# Altium schematic sheet Main.SchDoc
size A0; SheetNumber: 1; SheetTotal: 1
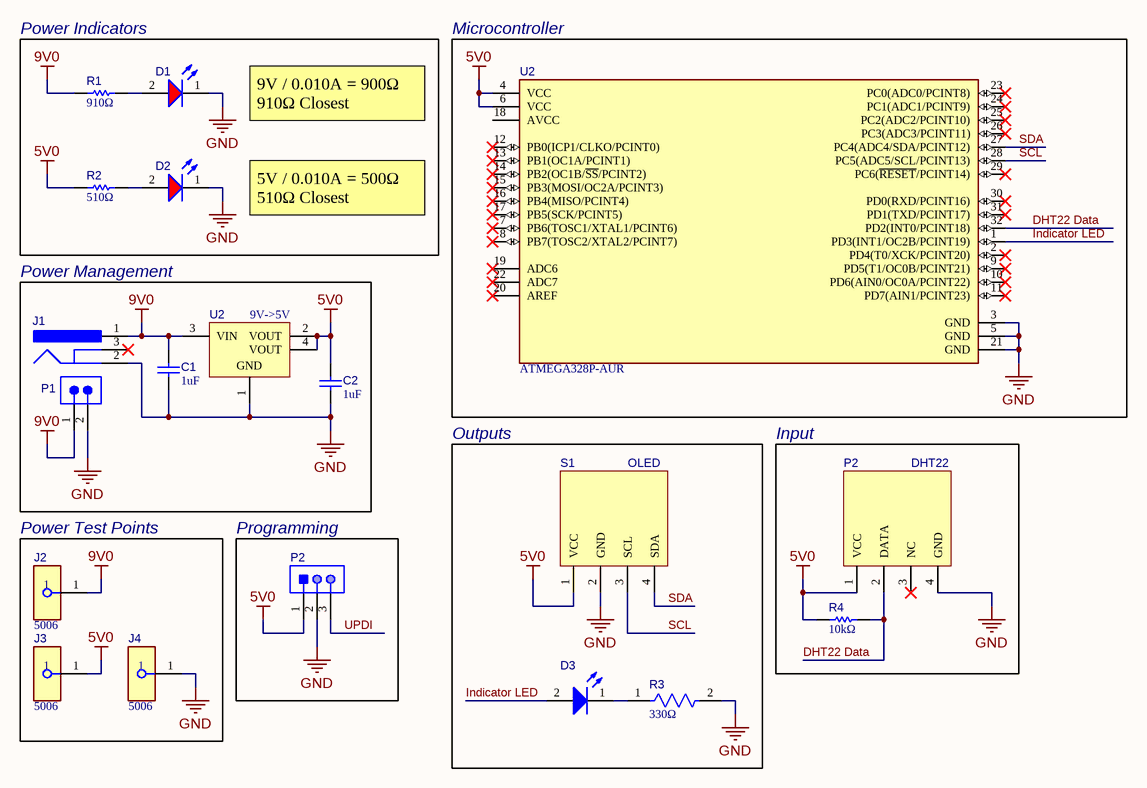
[diagram p0: Main.SchDoc]

## Parts
(Parts that share a designator on the sheet are numbered #1, #2 ... from top to bottom, then left to right.)
C1  1uF  [CAPC3216X180X50ML20T25]
C2  1uF  [CAPC3216X180X50ML20T25]
D1  150120SS75000  [WL-SMCW_1206_150120xx75000]  (value not drawn)
D2  150120SS75000  [WL-SMCW_1206_150120xx75000]  (value not drawn)
D3  150120BS75000  [WL-SMCW_1206_150120xx75000]  (value not drawn)
J1  Power Jack  [CUI-PJ-002A_V]  (value not drawn)
J2  5006  [FP-5006-MFG]
J3  5006  [FP-5006-MFG]
J4  5006  [FP-5006-MFG]
P1  61300211121  [61300211121]  (value not drawn)
P2#1  DHT22  [DHT22]
P2#2  22-23-2031  [MOLX-22-23-2031_V]  (value not drawn)
R1  910Ω  [RESC3216X70X50ML20T25]
R2  510Ω  [RESC3216X60X45ML10T20]
R3  330Ω  [FP-CRCW1206-e3-IPC_A]
R4  10kΩ  [RESC3116X65X40ML10T20]
S1  OLED  [display]
U2#1  ATMEGA328P-AUR  [FP-32A-MFG]
U2#2  9V->5V  [SOT-223_L]

## Blocks framed on the sheet
Power Indicators: D1 D2 R1 R2
Microcontroller: U2#1
Power Management: C1 C2 J1 P1 U2#2
Outputs: D3 R3 S1
Input: P2#1 R4
Power Test Points: J2-J4
Programming: P2#2

## Nets
5V0: C2.2 J3.1 P2#1.1(VCC) P2#2.1 R2.1 R4.1 S1.1(VCC) U2#1.4(VCC) U2#1.6(VCC) U2#2.2(VOUT) U2#2.4(VOUT)
9V0: C1.2 J1.1 J2.1 P1.1 R1.1 U2#2.3(VIN)
GND: C1.1 C2.1 D1.1(K) D2.1(K) J1.2 J4.1 P1.2 P2#1.4(GND) P2#2.2 R3.2 S1.2(GND) U2#1.3(GND) U2#1.5(GND) U2#1.21(GND) U2#2.1(GND)
DHT22 Data: P2#1.2(DATA) R4.2 U2#1.32(PD2(INT0/PCINT18))
Indicator LED: D3.2(A) U2#1.1(PD3(INT1/OC2B/PCINT19))
SCL: S1.3(SCL) U2#1.28(PC5(ADC5/SCL/PCINT13))
SDA: S1.4(SDA) U2#1.27(PC4(ADC4/SDA/PCINT12))
UPDI: P2#2.3
NetD1_2: D1.2(A) R1.2
NetD2_2: D2.2(A) R2.2
NetD3_1: D3.1(K) R3.1

Not connected (* = marked no-connect by the designer): J1 3*; P2#1 3(NC)*; U2#1 2(PD4(T0/XCK/PCINT20))* 7(PB6(TOSC1/XTAL1/PCINT6))* 8(PB7(TOSC2/XTAL2/PCINT7))* 9(PD5(T1/OC0B/PCINT21))* 10(PD6(AIN0/OC0A/PCINT22))* 11(PD7(AIN1/PCINT23))* 12(PB0(ICP1/CLKO/PCINT0))* 13(PB1(OC1A/PCINT1))* 14(PB2(OC1B/~{SS}/PCINT2))* 15(PB3(MOSI/OC2A/PCINT3))* 16(PB4(MISO/PCINT4))* 17(PB5(SCK/PCINT5))* 18(AVCC) 19(ADC6)* 20(AREF)* 22(ADC7)* 23(PC0(ADC0/PCINT8))* 24(PC1(ADC1/PCINT9))* 25(PC2(ADC2/PCINT10))* 26(PC3(ADC3/PCINT11))* 29(PC6(~{RESET}/PCINT14))* 30(PD0(RXD/PCINT16))* 31(PD1(TXD/PCINT17))*

## Notes on the sheet
- 9V / 0.010A = 900Ω 910Ω Closest
- 5V / 0.010A = 500Ω 510Ω Closest

## Library data of the parts
C1 C2 = CMP-2000-04991-1: Chip Capacitor, 1 uF, +/- 10%, 25 V, -55 to 125 degC, 1206 (3216 Metric), RoHS, Tape and Reel; Manufacturer: Kemet; Temperature Coefficient / Code: +/-15%; Dielectric: X7R; Voltage Rating DC: 25V; Capacitance - nF: 1000nF; Class: Class1; Case Length: 3.2mm; Type: SMDMLCCX7R6.3-250VDCCommericalGrade; Case Width: 1.6mm; Product: GeneralTypeMLCCs; Capacitance: 1uF; Datasheet URL: https://ciiva.com/datasheet-click-18194173?src=ciiva&sig=6daff8c4; Operating Temperature Range: -55Cto+125C; Series: C1206C; RoHS: Details; Product Category: MultilayerCeramicCapacitorsMLCC-SMD/SMT; Manufacturer URL: http://www.kemet.com/; Minimum Operating Temperature: -55C; Dimensions: 1.6mmWx3.2mmLx1.6mmH; Termination Style: SMD/SMT; Brand: Kemet; Packaging: Reel; Package / Case: 1206(3216metric); Case Code - mm: 3216; Datasheet Version: Jul-14; Factory Pack Quantity: 2000; Package Description: 2-Pin Surface Mount Device, Body 3.2 x 1.6 mm; Tolerance: 10%; Package Reference: 1206; Case Height: 1.6mm; Case Code - in: 1206; Maximum Operating Temperature: +125C; Voltage Rating: 25V
D1 D2 = CMP-1426-00017-3: Led, Red, 630 Nm, 1.9 V, 30 Ma, 60 Mcd Rohs Compliant: Yes; Forward Current: 100mA; Max Reverse Voltage (DC): 5V; Lens Style: Clear, Rectangular; Viewing Angle: 140°; Luminous Intensity: 60mcd; Peak Wavelength: 645nm; Forward Voltage: 1.9V; Test Current: 20mA; Dominant Wavelength: 630nm; Case Code (Imperial): 1206; Length: 3.2mm; Mount: Surface Mount; Case Code (Metric): 3216; Case/Package: 1206; Min Operating Temperature: -40°C; Width: 1.6mm; Color: Red; Height: 680µm; REACH SVHC: Unknown; Max Operating Temperature: 85°C; Wavelength: 630nm; RoHS: Compliant; Packaging: Tape and Reel
D3 = CMP-1426-00015-3: WL-SMCW SMT Mono-Color Chip LED Waterclear; Manufacturer Package Identifier: LED_1206; Dominant Wavelength: 470nm; Lens Style: Clear, Rectangular; Test Current: 20mA; Forward Voltage: 3.2V; Forward Current: 100mA; Peak Wavelength: 465nm; Max Reverse Voltage (DC): 5V; Viewing Angle: 140°; Color: Blue; Luminous Intensity: 145mcd; Max Operating Temperature: 85°C; Case Code (Imperial): 1206; Length: 3.2mm; Width: 1.6mm; Min Operating Temperature: -40°C; Height: 680µm; Case Code (Metric): 3216; Packaging: Tape and Reel; RoHS: Compliant; Case/Package: 1206; REACH SVHC: Unknown; Wavelength: 470nm; Mount: Surface Mount
J1 = CMP-2000-06895-2: Through Hole Right Angle DC Power Jack, 2.5 A, 2 mm Center Pin, 3 Position, -25 to 85 degC, RoHS, Bulk; Manufacturer: CUIInc.; Brand: CUI; Inside Contact Diameter: 2mm; Voltage Rating: 24V; Outside Contact Diameter: 6.5mm; Current Rating: 2.5A; Insulation Resistance: 50MOhms; Contact Gender: Male; Connector Type: DCPowerJack; Datasheet Version: Rev. 1.03, 04/2016; Housing Material: PolybutyleneTerephthalate(PBT); Operating Temperature Range: -25Cto+85C; Termination Style: ThroughHole; Product Category: DCPowerConnectors; Mounting Technology: ThroughHole; Mounting Style: ThroughHole; Factory Pack Quantity: 500; Contact Plating: Nickel; Package Reference: PJ-002A; Mounting Angle: Right; Package Description: 3-Pin Through Hole Device, Body 14.4 x 9 mm, Height 11 mm; Flammability Rating: UL94V-0; Manufacturer URL: http://www.cui.com/; Product: Jacks; Contact Material: Copper; Datasheet URL: http://www.cui.com/product/resource/pj-002a.pdf; RoHS: True
J2-J4 = CMP-19636-000022-1: PC TEST POINT COMPACT BLACK; Body Material: Bronze; Inside Diameter: 1.78mm; Number of Ports: 1; Hole Diameter: 1.6mm; Outside Diameter: 3.18mm; Plating: Silver; Contact Plating: Tin; Color: Black; RoHS Compliant: Yes; Flammability Rating: UL94 V-0; Contact Material: Bronze; Material: Nylon; Orientation: Straight; Package Quantity: 100; Housing Color: Black; Length: 8.89mm; Series: THM; Mount: PCB; Height: 0.35inch; Packaging: Bulk; REACH SVHC: No SVHC; Insulation Material: Nylon; Lead Free: Lead Free
P1 = CMP-1712-00002-6: NexarPartId: 20081794; Number of Contacts: 2; Pitch: 2.54mm; Connector Type: Male Pin; Voltage Rating: 250V; Current Rating: 3A; Gender: Male; Contact Resistance: 20mΩ; Height: 8.94mm; Lead Free: Lead Free; Number of Pins: 2; Termination: Through Hole; RoHS: Compliant; Lead Pitch: 2.54mm; REACH SVHC: No SVHC; Housing Material: PBT; Contact Mating Length: 5.9944mm; Min Operating Temperature: -40°C; Orientation: Vertical; Contact Material: Copper; Contact Gender: Male; Max Operating Temperature: 125°C; Number of Rows: 1; Number of Positions: 2; Packaging: Bulk; Contact Plating: Gold; Mount: Through Hole; Color: Black; Operating Supply Voltage: 250V
P2#1 = DHT22: 4.2 mm Pitch Mini-Fit Jr.Power Connector, Vertical, Through Hole, 6 Circuits, -40 to 105 degC, RoHS, Bag; Pitch: 4.2 mm; No. of Positions: 6; No. of Rows: 2; PartNumber: 39-28-1063; ComponentLink3Description: Package Specification; ComponentLink1URL: http://www.molex.com/; PackageVersion: Rev. F, 06/2009; Orientation: Vertical; ComponentLink3URL: http://www.molex.com/pdm_docs/sd/039281063_sd.pdf; ComponentLink2Description: Datasheet; PackageDescription: 6-Pin PCB Header, Vertical, Pitch 4.2 mm, Through Hole; ComponentLink1Description: Manufacturer URL; Temperature Min: -40 degC; RoHS: TRUE; Packing: Bag; Mounting Technology: Through Hole; Temperature Max: 105 degC; ComponentLink2URL: http://www.molex.com/webdocs/datasheets/pdf/en-us/0039281063_PCB_HEADERS.pdf
P2#2 = CMP-2000-05242-1: Male Header, Pitch 2.54 mm, 1 x 3 Position, Height 8.18 mm, Tail Length 3.56 mm, RoHS, Bulk; Current Rating: 4A; Brand: Molex; Pitch: 2.54mm; Voltage Rating: 250V; Mounting Angle: Vertical; Type: Locking; Factory Pack Quantity: 16000; Tradename: KK; Housing Material: Nylon; Contact Material: Brass; Manufacturer URL: http://www.molex.com/; Termination Style: ThroughHole; Mounting Style: ThroughHole; Number of Positions: 3Position; Contact Gender: Pin(Male); Packaging: Bulk; Series: 6373; Datasheet Version: Sep-01; Contact Plating: Tin; Product: Headers; Datasheet URL: https://datasheet.ciiva.com/19472/232274-19472863.pdf; RoHS: Details; Product Category: Headers&WireHousings; Manufacturer: Molex; Number of Rows: 1Row
R1 = CMP-2003-00012-1: Manufacturer: Panasonic; Part Number: ERA8AEB911V
R2 = CMP-2003-02257-1: Manufacturer: Vishay Dale; Part Number: CRCW1206510RFKEA
R3 = CMP-2003-02098-2: RES Thick Film, 330Ω, 1%, 0.25W, 100ppm/°C, 1206; Voltage Rating: 200V; Resistance: 330R; Max Power Dissipation: 250mW; Height: 0.55mm; Mount: Surface Mount; Min Operating Temperature: -55°C; Depth: 1.6mm; Features: Automotive AEC-Q200; Voltage Rating (DC): 200V; Military Standard: Not; Packaging: Tape and Reel; Composition: Thick Film; Contact Plating: Tin; Case Code (Imperial): 1206; Case/Package: 1206; Number of Terminations: 2; Length: 3.2mm; Lead Free: Lead Free; Tolerance: 1%; Temperature Coefficient: 100ppm/°C; Case Code (Metric): 3216; Width: 1.6mm; Weight: 0.000353oz; Termination: SMD/SMT; Radiation Hardening: No; Package Quantity: 10; Power Rating: 250mW; Max Operating Temperature: 155°C
R4 = CMP-1014-00623-2: Chip Resistor, 10 KOhm, +/- 1%, 0.25 W, -55 to 155 degC, 1206 (3216 Metric), RoHS, Tape and Reel; Manufacturer: Yageo; Voltage Rating: 200V; Resistance: 10KOhm; Temperature Coefficient: 100ppm/degreesC; Power Rating: 250mW; Packaging: TapeandReel; Termination: SMD/SMT; REACH SVHC: Unknown; Tolerance: 1%; Height: 0.55mm; Composition: ThickFilm; Max Operating Temperature: 155degC; Datasheet Version: Rev. 5, 10/2016; Lead Free: LeadFree; Case Code (Metric): 3216; Depth: 1.6mm; Package Quantity: 5000; RoHSCompliant: true; Military Standard: Not; Case/Package: 1206; Case Code (Imperial): 1206; Min Operating Temperature: -55degC; Datasheet URL: http://www.yageo.com/NewPortal/yageodocoutput?fileName=/pdf/R-Chip/PYu-RC_Group_51_RoHS_L_5.pdf; Length: 3.1mm; Manufacturer URL: http://www.yageo.com/; Package Reference: 1206.0; Width: 1.6mm; Package Description: 2-Pin Surface Mount Device, Body 3.1 x 1.6 mm
S1 = Screen: Small OLED display; Pitch: 4.2 mm; No. of Positions: 6; Packing: Bag; No. of Rows: 2; PartNumber: 39-28-1063; ComponentLink3Description: Package Specification; ComponentLink1URL: http://www.molex.com/; PackageVersion: Rev. F, 06/2009; Orientation: Vertical; ComponentLink3URL: http://www.molex.com/pdm_docs/sd/039281063_sd.pdf; ComponentLink2Description: Datasheet; PackageDescription: 6-Pin PCB Header, Vertical, Pitch 4.2 mm, Through Hole; ComponentLink1Description: Manufacturer URL; Temperature Min: -40 degC; RoHS: TRUE; Mounting Technology: Through Hole; Temperature Max: 105 degC; ComponentLink2URL: http://www.molex.com/webdocs/datasheets/pdf/en-us/0039281063_PCB_HEADERS.pdf
U2#1 = CMP-06276-000046-1: IC MCU 8BIT 32KB FLASH 32TQFP; Number of I/Os: 32; Oscillator Type: Internal; Peripherals: Brown-out Detect/Reset; Core Architecture: PIC; Interface: I2C; Frequency: 40MHz; Case/Package: TQFP; Max Operating Temperature: 85°C; Min Operating Temperature: -40°C; Memory Size: 32KB; Packaging: Cut Tape; Memory Type: FLASH
U2#2 = CMP-0244-00312-1: Fixed Low Drop Positive Voltage Regulator, 5V, 4-Pin SOT-223, Tape and Reel; ComponentLink1URL: http://www.st.com; DatasheetVersion: 1/11/2011; PackageDescription: 4-Pin SOT-223 Package, 6.5 x 3.5 mm Body, 2.3 mm Pitch, 7 mm Lead Span; ComponentLink2URL: http://www.st.com/internet/com/TECHNICAL_RESOURCES/TECHNICAL_LITERATURE/DATASHEET/CD00000544.pdf; ComponentLink1Description: Manufacturer URL; PackageReference: SOT-223; PackageVersion: 2010; ComponentLink2Description: Datasheet